# EAGLE design PCB-DISP-BO (EAGLE 6.2)
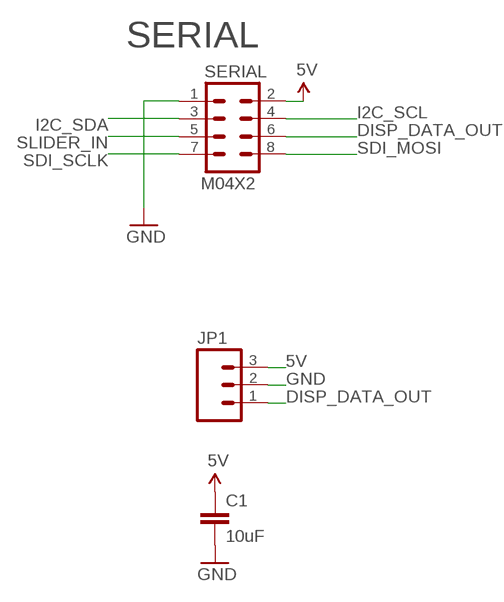
[diagram p0: schematic, sheet 1]

## Parts
C1  10uF  CAP0603-CAP  [0603-CAP]
JP1  M03PTH  [1X03]
SERIAL  M04X2  [2X4]

## Nets
5V [Power]: C1.1 JP1.3 SERIAL.2
DISP_DATA_OUT: JP1.1 SERIAL.6
GND [Power]: C1.2 JP1.2 SERIAL.1
I2C_SCL: SERIAL.4
I2C_SDA: SERIAL.3
SDI_MOSI: SERIAL.8
SDI_SCLK: SERIAL.7
SLIDER_IN: SERIAL.5

## Notes on the sheet
- SERIAL

## Library data of the parts
C1 = SparkFun:CAP: Capacitor Standard 0603 ceramic capacitor, and 0.1" leaded capacitor.
JP1 = SparkFun:M03: Header 3 Standard 3-pin 0.1" header. Use with straight break away headers (SKU : PRT-00116), right angle break away headers (PRT-00553), swiss pins (PRT-00743), machine pins (PRT-00117), and female headers (PRT-00115). Molex polarized connector foot print use with SKU : PRT-08232 with associated crimp pins and housings.
SERIAL = SparkFun:M04X2

## Net classes
0 default: width 0.203 mm, drill 0.406 mm, clearance 0.203 mm
1 Power: width 0.406 mm, drill 0.61 mm, clearance 0.203 mm

## Board
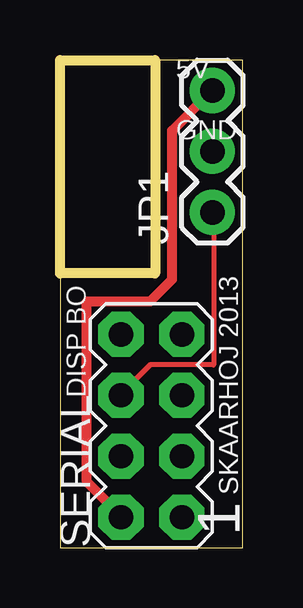
[diagram p1: board, top side]
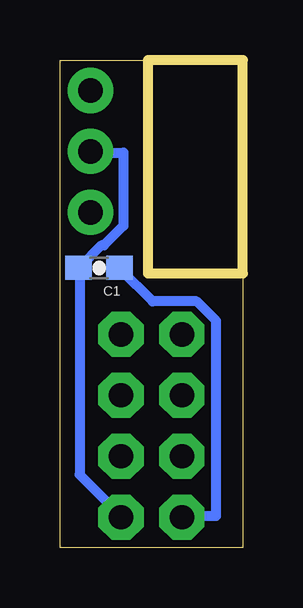
[diagram p2: board, bottom side, seen from below]

Size 7.62 x 20.32 mm. Coordinates in mm from the lower left corner, seen from the top.
Outline: 3.96,20.32 7.62,20.32 7.62,0 0,0 0,11.43
Outline: 3.96,20.32 0,20.32 0,11.43
Outline: 3.96,20.32 3.96,11.43 0,11.43
Copper layers (1*16): Top 0.035mm / dielectric 1.5mm / Bottom 0.035mm
Design rules: minimum track width 6mil, minimum drill 12mil, track to track 6mil, track to pad 6mil, pad to pad 6mil, via to via 6mil, smd to smd 0mil, copper to edge 10mil, drill to drill 10mil, minimum pad ring 10mil, minimum via ring 6mil, stop-mask expansion 2mil, vias tented up to drill 100mil, thermal gap 10mil

### Footprints (pad centres in the part's own frame; a part is rotated, then mirrored left to right if it is on the bottom)
0603-CAP = smd 1.1 x 1: 1 -0.85,0; 2 0.85,0
1X03 = drill 1.016 pad 1.88: 1 0,0; 2 2.54,0; 3 5.08,0
2X4 = drill 1.016 pad 1.88 octagon: 1 -3.81,-1.27; 2 -3.81,1.27; 3 -1.27,-1.27; 4 -1.27,1.27; 5 1.27,-1.27; 6 1.27,1.27; 7 3.81,-1.27; 8 3.81,1.27

### Placement (x,y rotation side)
C1  5.99,11.66 180 bottom
JP1  6.35,13.97 90 top
SERIAL  3.81,5.08 90 top

### Tracks (layer width: path | path; a pad name or v marks a point on that pad's centre or on a via)
5V
  Top 0.406: JP1.3 4.67,17.37 4.67,11.18 3.76,10.26 1.12,10.26 1.12,2.74 2.54,1.32 SERIAL.2
  Bottom 0.406: C1.1 5.08,11.58 3.76,10.26 1.93,10.26 1.12,9.45 1.12,1.32 2.54,1.32 SERIAL.2
DISP_DATA_OUT
  Top 0.203: SERIAL.6 2.54,6.4 3.76,7.62 6.4,7.62 6.4,13.92 JP1.1
GND
  Bottom 0.406: JP1.2 6.3,16.46 4.98,16.46 4.98,13.41 5.79,12.6 5.89,12.6 6.81,11.68 C1.2 6.81,11.48 6.81,3.05 5.08,1.32 SERIAL.1

### Text on the board
_tsilk: 5V | GND | DISP BO | 1 | SKAARHOJ 2013